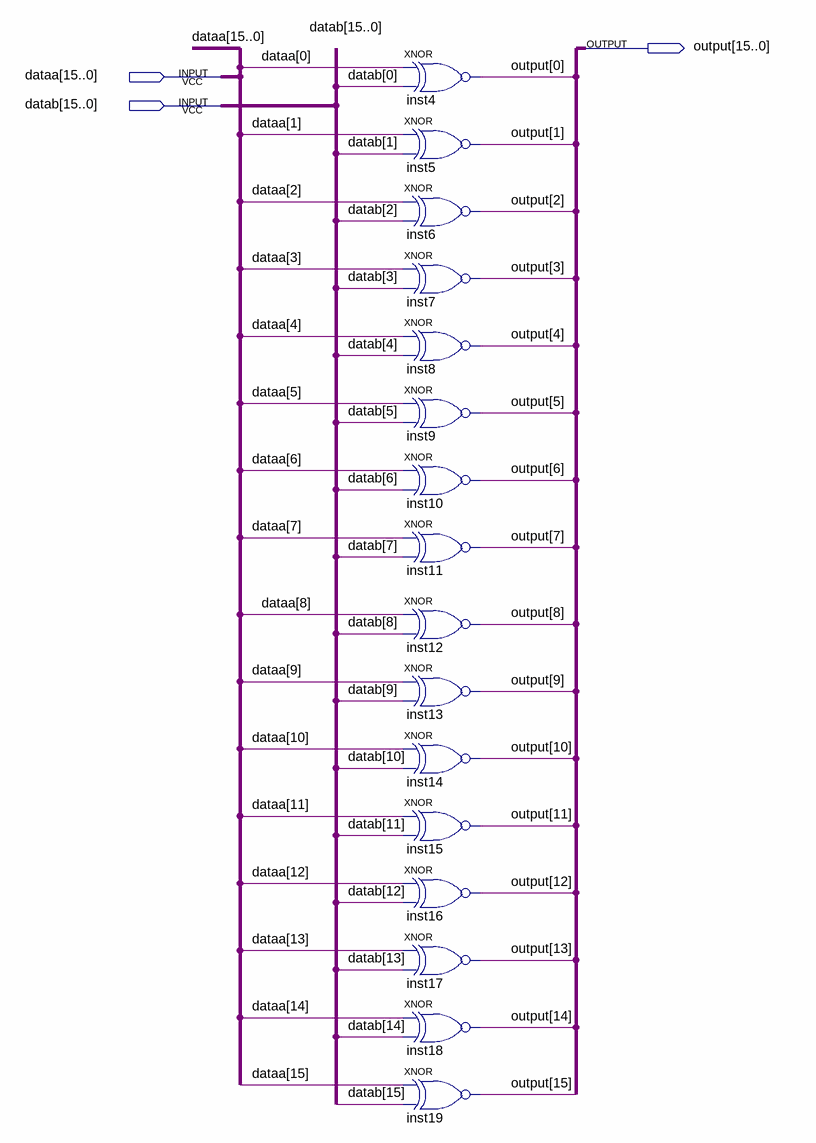
[diagram p0: schematic sheet]
// Quartus schematic NXor.bdf as structural Verilog: 16 symbols, 3 pins
module NXor (
  input  [15:0] dataa,
  input  [15:0] datab,
  output [15:0] \output 
);

  xnor inst4 (\output [0], dataa[0], datab[0]);
  xnor inst5 (\output [1], dataa[1], datab[1]);
  xnor inst6 (\output [2], dataa[2], datab[2]);
  xnor inst7 (\output [3], dataa[3], datab[3]);
  xnor inst8 (\output [4], dataa[4], datab[4]);
  xnor inst9 (\output [5], dataa[5], datab[5]);
  xnor inst10 (\output [6], dataa[6], datab[6]);
  xnor inst11 (\output [7], dataa[7], datab[7]);
  xnor inst12 (\output [8], dataa[8], datab[8]);
  xnor inst13 (\output [9], dataa[9], datab[9]);
  xnor inst14 (\output [10], dataa[10], datab[10]);
  xnor inst15 (\output [11], dataa[11], datab[11]);
  xnor inst16 (\output [12], dataa[12], datab[12]);
  xnor inst17 (\output [13], dataa[13], datab[13]);
  xnor inst18 (\output [14], dataa[14], datab[14]);
  xnor inst19 (\output [15], dataa[15], datab[15]);
endmodule
